# Altium schematic sheet Motor_Buttons.SchDoc
size A4; SheetNumber: 2; SheetTotal: 7
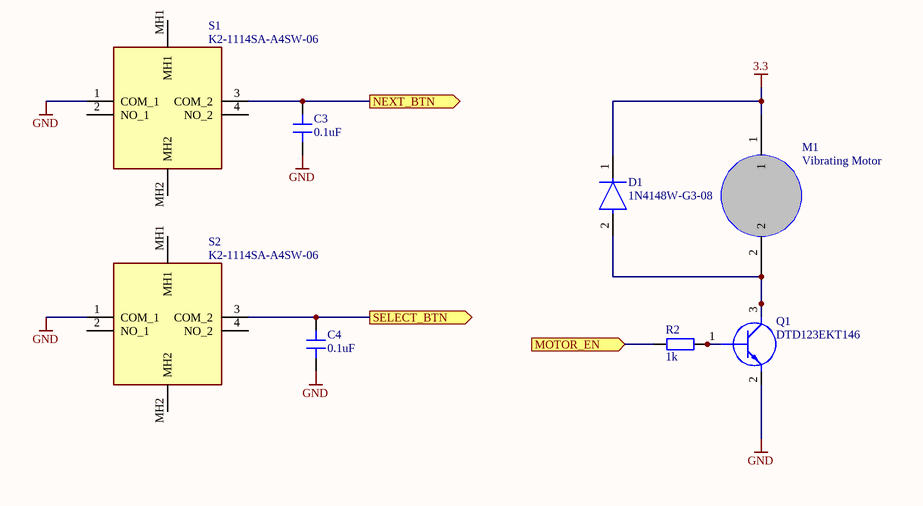
[diagram p0: Motor_Buttons.SchDoc]

## Parts
C3  0.1uF  [0603_CAP]
C4  0.1uF  [0603_CAP]
D1  1N4148W-G3-08  [SOD3716X135N]
M1  Vibrating Motor  [Motor]
Q1  DTD123EKT146  [FP-SS8050-G-IPC_A]
R2  1k  [0402_RES]
S1  K2-1114SA-A4SW-06  [K21114SAA4SW06]
S2  K2-1114SA-A4SW-06  [K21114SAA4SW06]

## Ports
MOTOR_EN (in, see Smart-Watch-Front[3C]), NEXT_BTN (out, see Smart-Watch-Front[4C]), SELECT_BTN (out, see Smart-Watch-Front[4C])

## Nets
3.3: D1.1(C) M1.1
GND: C3.2 C4.2 Q1.2(E) S1.1(COM_1) S2.1(COM_1)
MOTOR_EN: R2.1 ; port MOTOR_EN
NEXT_BTN: C3.1 S1.3(COM_2) ; port NEXT_BTN
SELECT_BTN: C4.1 S2.3(COM_2) ; port SELECT_BTN
NetD1_2: D1.2(A) M1.2 Q1.3(C)
NetQ1_1: Q1.1(B) R2.2

Not connected (* = marked no-connect by the designer): S1 2(NO_1) 4(NO_2) MH1 MH2; S2 2(NO_1) 4(NO_2) MH1 MH2

## Library data of the parts
C3 C4 = C
D1 = CMP-00030-46456310-1: 1N4148W-G3-08 Rectifier Diode, 1 Phase, 1 Element, 0.15A, 100V V(RRM), Silicon; Forward Current: 150mA; Reverse Recovery Time: 4ns; Peak Non-Repetitive Surge Current: 500mA; Element Configuration: Single; Forward Voltage: 1.2V; Max Reverse Voltage (DC): 75V; Schedule B: 8541100070, 8541100070|8541100070|8541100070|8541100070|8541100070; Max Repetitive Reverse Voltage (Vrrm): 100V; Weight: 9.412042mg; NexarPartId: 46456310; Contact Plating: Tin; Max Operating Temperature: 150°C; Case/Package: SOD; Mount: Surface Mount; RoHS: Compliant; Min Operating Temperature: -55°C; Average Rectified Current: 150mA; Number of Pins: 2
M1 = Component_1
Q1 = DTD123EKT146: Transistor BJT NPN; Manufacturer_Name: ROHM Semiconductor; Datasheet Link: http://rohmfs.rohm.com/en/products/databook/datasheet/discrete/transistor/digital/dtd123ekt146-e.pdf; Height: 1.3mm; Manufacturer_Part_Number: DTD123EKT146; Mouser Part Number: 755-DTD123EKT146; Mouser Price/Stock: https://www.mouser.com/Search/Refine.aspx?Keyword=755-DTD123EKT146
R2 = R
S1 S2 = K2-1114SA-A4SW-06: Switch; Manufacturer_Name: Korean Hroparts Elec; Datasheet Link: https://datasheet.lcsc.com/szlcsc/Korean-Hroparts-Elec-K2-1114SA-A4SW-06_C136662.pdf; Height: 1.65mm; Manufacturer_Part_Number: K2-1114SA-A4SW-06